# Altium schematic sheet CELLULAR.SchDoc
size A3
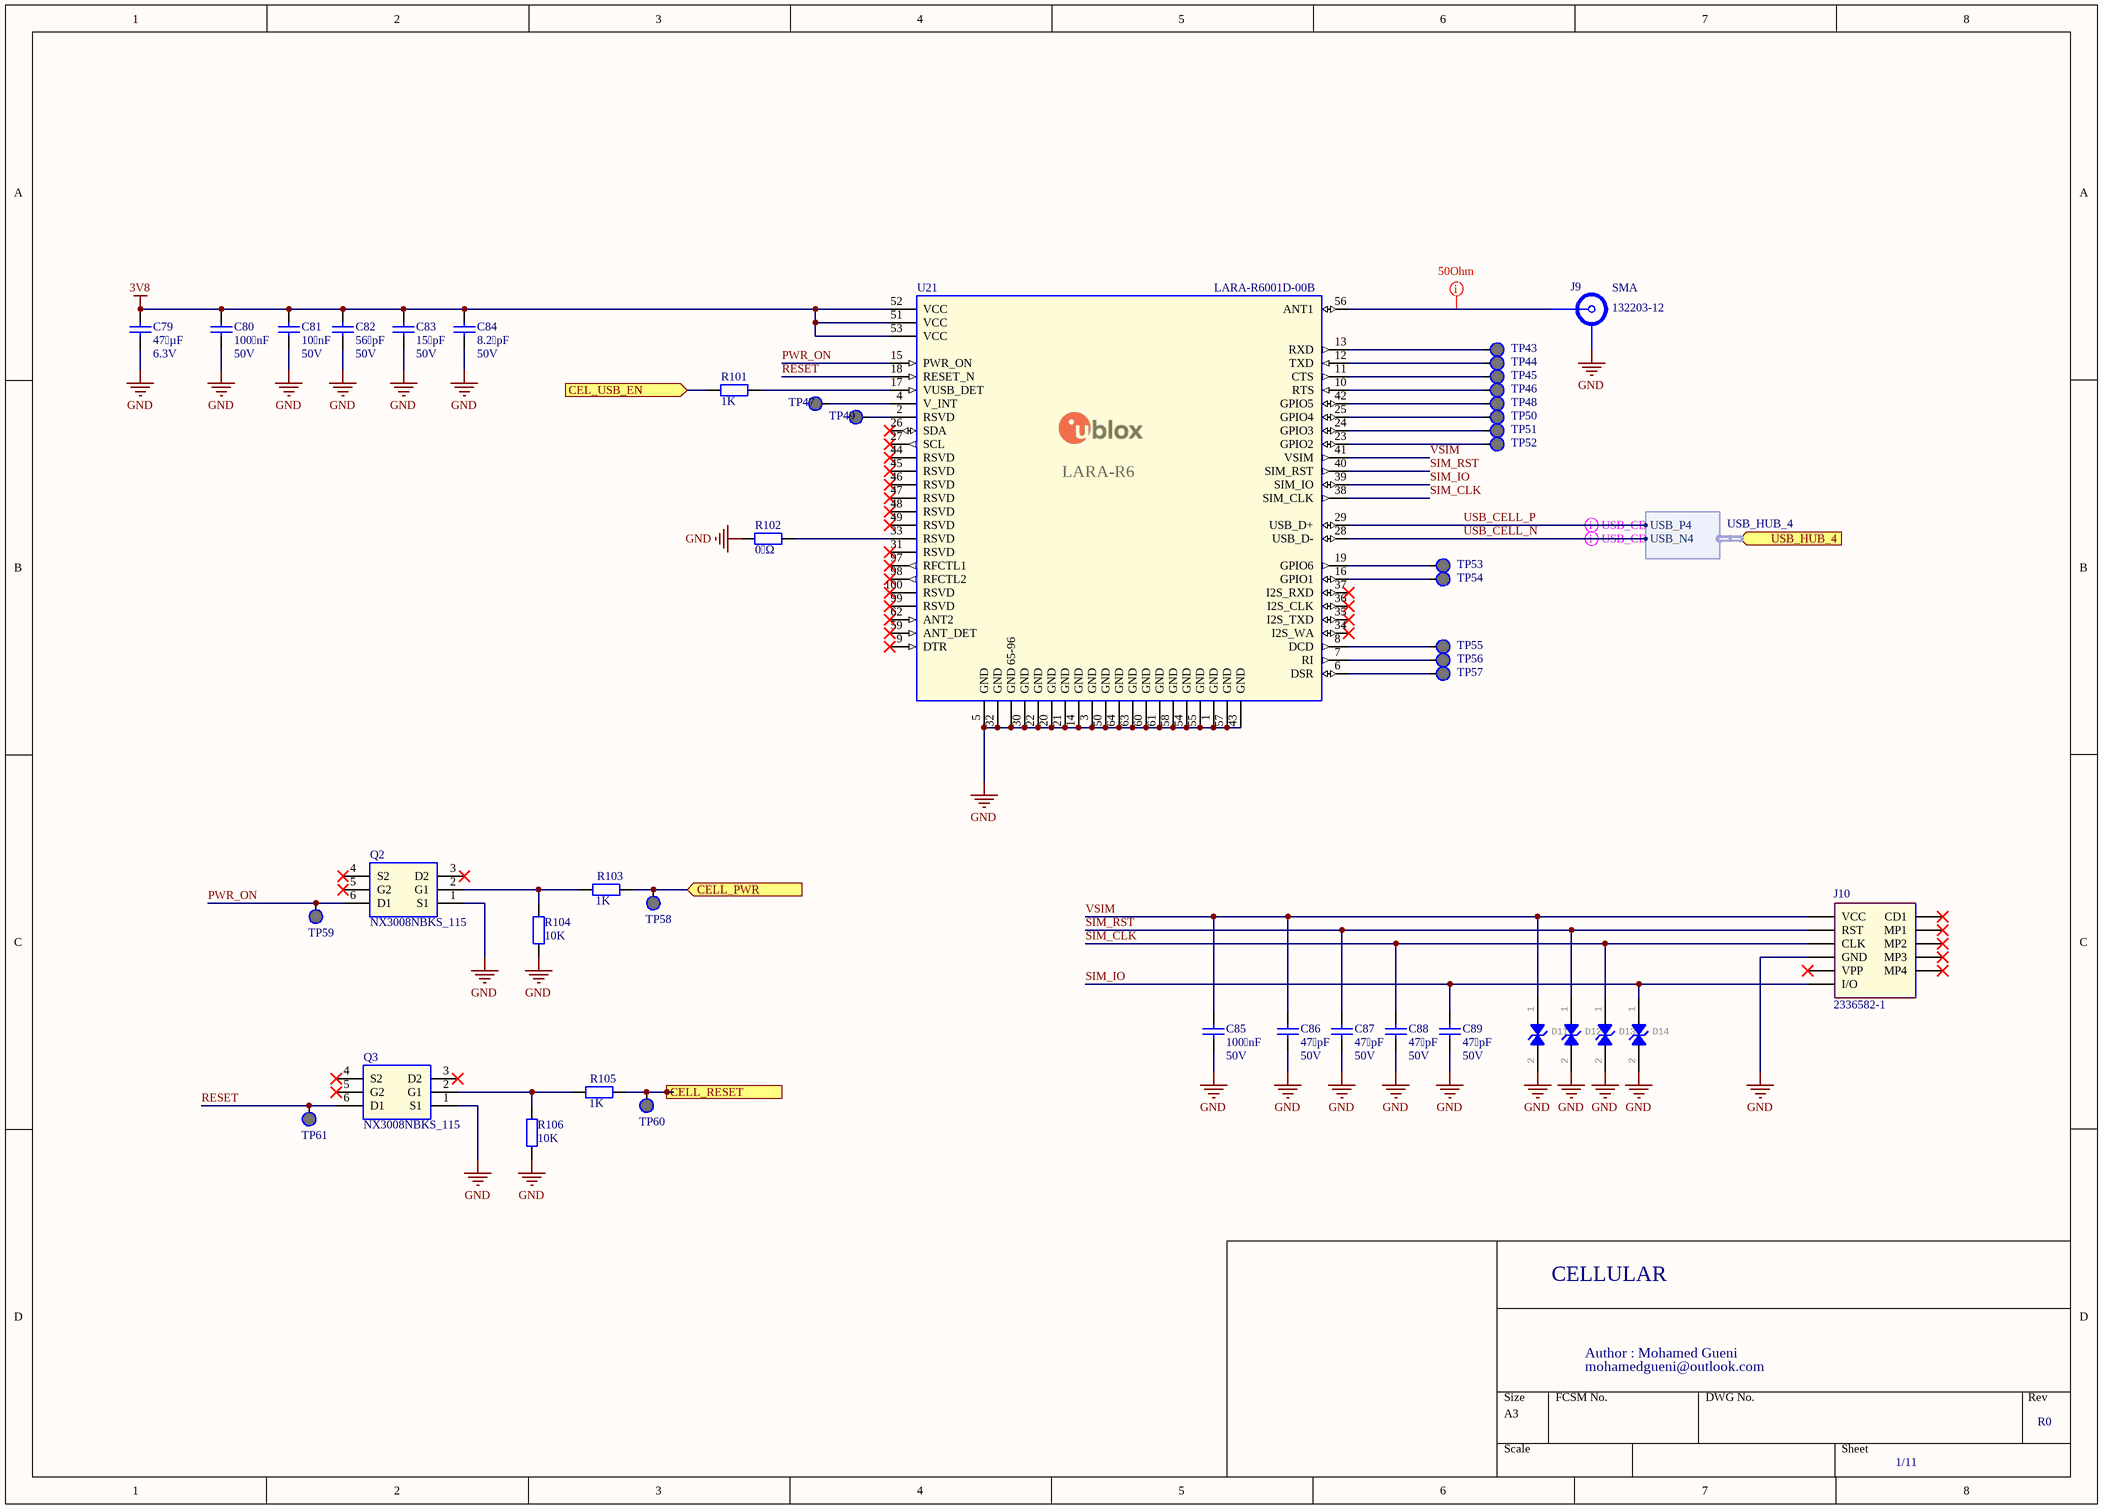
[diagram p0: CELLULAR.SchDoc]

## Parts
C79  Value 1: 47 µF  Value 2: 6.3V  [CAPC1210]  (hidden comment: T491D476K006AT)
C80  Value 1: 100 nF  Value 2: 50V  [CAPC1608N]  (hidden comment: GRM188R71H104KA93D)
C81  Value 1: 10 nF  Value 2: 50V  [CAPC1608N]  (hidden comment: GRM188R71H103KA01D)
C82  Value 1: 56 pF  Value 2: 50V  [CAPC402]  (hidden comment: KGM05ACG1H560KH)
C83  Value 1: 15 pF  Value 2: 50V  [CAPC1608N]  (hidden comment: GRM1885C1H150JA01D)
C84  Value 1: 8.2 pF  Value 2: 50V  [CAPC402]  (hidden comment: GRM1555C1H8R2CA01D)
C85  Value 1: 100 nF  Value 2: 50V  [CAPC1608N]  (hidden comment: GRM188R71H104KA93D)
C86  Value 1: 47 pF  Value 2: 50V  [CAPC402]  (hidden comment: C0402C470J5GAC)
C87  Value 1: 47 pF  Value 2: 50V  [CAPC402]  (hidden comment: C0402C470J5GAC)
C88  Value 1: 47 pF  Value 2: 50V  [CAPC402]  (hidden comment: C0402C470J5GAC)
C89  Value 1: 47 pF  Value 2: 50V  [CAPC402]  (hidden comment: C0402C470J5GAC)
D11  CDSOD323-T12LC  [CDSOD323T12LC]  (value not drawn)
D12  CDSOD323-T12LC  [CDSOD323T12LC]  (value not drawn)
D13  CDSOD323-T12LC  [CDSOD323T12LC]  (value not drawn)
D14  CDSOD323-T12LC  [CDSOD323T12LC]  (value not drawn)
J9  132203-12  [13220312]
J10  2336582-1  [23365821]
Q2  NX3008NBKS_115  [SOT65P210X110-6N]
Q3  NX3008NBKS_115  [SOT65P210X110-6N]
R101  Value 1: 1K  [RESC1608N]  (hidden comment: RN731JTTD1001F25)
R102  Value 1: 0 Ω  [RESC1608N]  (hidden comment: RMCF0603ZT0R00)
R103  Value 1: 1K  [RESC1608N]  (hidden comment: Resistor)
R104  Value 1: 10K  [RESC1608N]  (hidden comment: Resistor)
R105  Value 1: 1K  [RESC1608N]  (hidden comment: Resistor)
R106  Value 1: 10K  [RESC1608N]  (hidden comment: Resistor)
TP43  Test Point  [TP]  (value not drawn)  (no BOM)
TP44  Test Point  [TP]  (value not drawn)  (no BOM)
TP45  Test Point  [TP]  (value not drawn)  (no BOM)
TP46  Test Point  [TP]  (value not drawn)  (no BOM)
TP47  Test Point  [TP]  (value not drawn)  (no BOM)
TP48  Test Point  [TP]  (value not drawn)  (no BOM)
TP49  Test Point  [TP]  (value not drawn)  (no BOM)
TP50  Test Point  [TP]  (value not drawn)  (no BOM)
TP51  Test Point  [TP]  (value not drawn)  (no BOM)
TP52  Test Point  [TP]  (value not drawn)  (no BOM)
TP53  Test Point  [TP]  (value not drawn)  (no BOM)
TP54  Test Point  [TP]  (value not drawn)  (no BOM)
TP55  Test Point  [TP]  (value not drawn)  (no BOM)
TP56  Test Point  [TP]  (value not drawn)  (no BOM)
TP57  Test Point  [TP]  (value not drawn)  (no BOM)
TP58  Test Point  [TP]  (value not drawn)  (no BOM)
TP59  Test Point  [TP]  (value not drawn)  (no BOM)
TP60  Test Point  [TP]  (value not drawn)  (no BOM)
TP61  Test Point  [TP]  (value not drawn)  (no BOM)
U21  LARA-R6001D-00B  [LARA-R6]

## Ports
CEL_USB_EN (in), CELL_PWR (in), CELL_RESET (in), USB_HUB_4 (in, harness USB_HUB_4)

## Harnesses
USB_HUB_4: USB_P4, USB_N4

## Nets
3V8: C79.2 C80.1 C81.2 C82.2 C83.2 C84.2 U21.51(VCC) U21.52(VCC) U21.53(VCC)
GND: C79.1 C80.2 C81.1 C82.1 C83.1 C84.1 C85.2 C86.1 C87.1 C88.1 C89.1 D11.2 D12.2 D13.2 D14.2 J9.1,2,3,4 J10.C5(GND) Q2.1(S1) Q3.1(S1) R102.2 R104.1 R106.1 U21.1(GND) U21.3(GND) U21.5(GND) U21.14(GND) U21.20(GND) U21.21(GND) U21.22(GND) U21.30(GND) U21.32(GND) U21.43(GND) U21.50(GND) U21.54(GND) U21.55(GND) U21.57(GND) U21.58(GND) U21.60(GND) U21.61(GND) U21.63(GND) U21.64(GND) U21.65(GND_65-96)
CEL_USB_EN: R101.2 ; port CEL_USB_EN
CELL_PWR: R103.2 TP58.1 ; port CELL_PWR
CELL_RESET: R105.2 TP60.1 ; port CELL_RESET
PWR_ON: Q2.6(D1) TP59.1 U21.15(PWR_ON)
RESET: Q3.6(D1) TP61.1 U21.18(RESET_N)
SIM_CLK: C88.2 D13.1 J10.C3(CLK) U21.38(SIM_CLK)
SIM_IO: C89.2 D14.1 J10.C7(I/O) U21.39(SIM_IO)
SIM_RST: C87.2 D12.1 J10.C2(RST) U21.40(SIM_RST)
USB_CELL_N: U21.28(USB_D-) ; port USB_HUB_4.USB_N4
USB_CELL_P: U21.29(USB_D+) ; port USB_HUB_4.USB_P4
VSIM: C85.1 C86.2 D11.1 J10.C1(VCC) U21.41(VSIM)
NetJ9_5: J9.5 U21.56(ANT1)
NetQ2_2: Q2.2(G1) R103.1 R104.2
NetQ3_2: Q3.2(G1) R105.1 R106.2
NetR101_1: R101.1 U21.17(VUSB_DET)
NetR102_1: R102.1 U21.33(RSVD)
NetTP43_1: TP43.1 U21.13(RXD)
NetTP44_1: TP44.1 U21.12(TXD)
NetTP45_1: TP45.1 U21.11(CTS)
NetTP46_1: TP46.1 U21.10(RTS)
NetTP47_1: TP47.1 U21.4(V_INT)
NetTP48_1: TP48.1 U21.42(GPIO5)
NetTP49_1: TP49.1 U21.2(RSVD)
NetTP50_1: TP50.1 U21.25(GPIO4)
NetTP51_1: TP51.1 U21.24(GPIO3)
NetTP52_1: TP52.1 U21.23(GPIO2)
NetTP53_1: TP53.1 U21.19(GPIO6)
NetTP54_1: TP54.1 U21.16(GPIO1)
NetTP55_1: TP55.1 U21.8(DCD)
NetTP56_1: TP56.1 U21.7(RI)
NetTP57_1: TP57.1 U21.6(DSR)

Not connected (* = marked no-connect by the designer): J10 C6(VPP)* CD1* MP1* MP2* MP3* MP4*; Q2 3(D2)* 4(S2)* 5(G2)*; Q3 3(D2)* 4(S2)* 5(G2)*; U21 9(DTR)* 26(SDA)* 27(SCL)* 31(RSVD)* 34(I2S_WA)* 35(I2S_TXD)* 36(I2S_CLK)* 37(I2S_RXD)* 44(RSVD)* 45(RSVD)* 46(RSVD)* 47(RSVD)* 48(RSVD)* 49(RSVD)* 59(ANT_DET)* 62(ANT2)* 97(RFCTL1)* 98(RFCTL2)* 99(RSVD)* 100(RSVD)*

## Layout directives
mark named 50Ohm: NetJ9_5
differential pair; differential pair class USB_CELL_DIFFPAIR: USB_CELL_N, USB_CELL_P

## Notes on the sheet
- (near J9) SMA
- CELLULAR
- Author : Mohamed Gueni
- mohamedgueni@outlook.com
- R0
- 1/11

## Library data of the parts
C79 = CAP-000000029: MAN: KEMET; DES: Tantalum Capacitor, 47 µF, 6.3V, 1210; FTP: 1210; SUPREF: 581-T491D476K006AT; Part Number: CAP-000000029; MANREF: T491D476K006AT
C80 C85 = CAP-000000017: MAN: Murata; DES: Ceramic Capacitor, 100 nF, 50V, X7R, 0603; FTP: 603; SUPREF: 81-GRM188R71H104KA93D; Part Number: CAP-000000017; MANREF: GRM188R71H104KA93D
C81 = CAP-000000028: MAN: Murata; DES: Ceramic Capacitor, 10 nF, 50V, X7R, 0603; FTP: 603; SUPREF: 81-GRM188R71H103KA01D; Part Number: CAP-000000028; MANREF: GRM188R71H103KA01D
C82 = CAP-000000015: MAN: KYOCERA AVX; DES: Ceramic Capacitor, 56 pF, 50V, C0G, 0402; FTP: 402; SUPREF: 581-KGM05ACG1H560KH; Part Number: CAP-000000015; MANREF: KGM05ACG1H560KH
C83 = CAP-000000014: MAN: Murata; DES: Ceramic Capacitor, 15 pF, 50V, C0G, 0603; FTP: 603; SUPREF: 81-GRM1885C1H150JA01D; Part Number: CAP-000000014; MANREF: GRM1885C1H150JA01D
C84 = CAP-000000013: MAN: Murata; DES: Ceramic Capacitor, 8.2 pF, 50V, C0G, 0402; FTP: 402; SUPREF: 81-GRM1555C1H8R2CA01D; Part Number: CAP-000000013; MANREF: GRM1555C1H8R2CA01D
C86-C89 = CAP-000000012: MAN: KEMET; DES: Ceramic Capacitor, 47 pF, 50V, C0G, 0402; FTP: 402; SUPREF: 80-C0402C470J5GAC; Part Number: CAP-000000012; MANREF: C0402C470J5GAC
D11-D14 = TVS-000000003: MAN: Bourns; DES: ESD Protection Diodes / TVS Diodes Bidirectional Ultra Low Cap; Value 1: 12 V; Value 2: 11 A; TOL: _; FTP: SOD-323-2; SUP: Mouser; SUPREF: 652-CDSOD323-T12LC; Part Number: TVS-000000003; MANREF: CDSOD323-T12LC; NOTE: _
J9 = CON-000000014: MAN: Amphenol RF; DES: SMA Right-Angle Jack PCB THT Connector, 50Ω, 12.4GHz; FTP: THT; SUP: Mouser; SUPREF: 523-132203-12; Part Number: CON-000000014; MANREF: 132203-12
J10 = CON-000000015: 4FF SIM, Push-Push Type, 7 Position, 7 Loaded Positions, Signal, -40  80 C [-40  185 F], SIM Card Connectors; Manufacturer_Name: TE Connectivity; Geometry.Height: 1.62mm; DES: SIMM Connectors PUSH-PUSH NANO SIM CONNECTOR; FTP: SMT; SUP: Mouser; SUPREF: 571-2336582-1; Mouser Part Number: *; Mouser Price/Stock: *; Manufacturer_Part_Number: 2336582-1; Datasheet Link: https://www.te.com/en/product-2336582-1.html; Part Number: CON-000000015; MAN: TE Connectivity; MANREF: 2336582-1
Q2 Q3 = TRM-000000002: MAN: Nexperia; MANREF: NX3008NBKS,115; DES: MOSFETs 30 V, 350 mA dual N-channel Trench MOSFET; Value 1: 350 mA; Value 2: 30V; TOL: _; FTP: TSSOP-6; SUP: Mouser; SUPREF: 771-NX3008NBKS,115; Part Number: TRM-000000002; NOTE: -
R101 = RES-000000001: MAN: KOA Speer; DES: Thin Film Resistors - SMD 1kOhm,0603,1%,25ppm, 63mW,50V; Value 2: 0.63W; TOL: 1%; FTP: 0603; SUP: Mouser; SUPREF: 660-RN731JTTD1001F25; NOTE: _; Part Number: RES-000000001; MANREF: RN731JTTD1001F25
R102 = RES-0000000017: MAN: Stackpole Electronics; DES: Thick Film Resistor, 0 Ω (Jumper), 100 mW, 0603; TOL: 1%; FTP: 0603; SUP: Mouser; SUPREF: 71-CRCW06030000Z0EA; NOTE: _; Part Number: RES-0000000017; MANREF: RMCF0603ZT0R00
R103 R105 = RES-000000001: MAN: KOA Speer; MANREF: RN731JTTD1001F25; DES: Thin Film Resistors - SMD 1kOhm,0603,1%,25ppm, 63mW,50V; Value 2: 0.63W; TOL: 1%; FTP: 0603; SUP: Mouser; SUPREF: 660-RN731JTTD1001F25; NOTE: _; Part Number: RES-000000001
R104 R106 = RES-000000007: MAN: KOA Speer; MANREF: RN731JTTD1002F25; DES: Thin Film Resistors - SMD 10kOhm,0603,1%,25ppm ,63mW,50V; Value 2: 0.63W; TOL: 1%; FTP: 0603; SUP: Mouser; SUPREF: 660-RN731JTTD1002F25; NOTE: _; Part Number: RES-000000007
TP43-TP61 = MIS-000000002: MAN: _; Part Number: MIS-000000002; MANREF: _; DES: _; Value 1: _; Value 2: _; TOL: _; FTP: _; SUP: _; SUPREF: _; NOTE: _
U21 = GIC-000000015: MAN: u-blox; DES: Mobile Modules LTE/3G/GSM-Global-Data only B1,2,3,4,5,7,8,12,13,18,19,20,26,28 LGA, 24x26 mm, 150 pcs/ree; TOL: _; SUP: Mouser; SUPREF: 377-LARA-R6001D-00B; Part Number: GIC-000000015; MANREF: LARA-R6001D-00B; NOTE: _